# EasyEDA Pro project ProPrj_cap banks_2026-02-15.epro, schematic Schematic2
Board Name: scratchpad; Create Date: 2025-12-29; Page Name: P1; Project Name: cap bank training; Schematic Name: Schematic2; Update Date: 2025-12-30; Company: EasyEDA.com; Page Size: A4; Version: V1.0
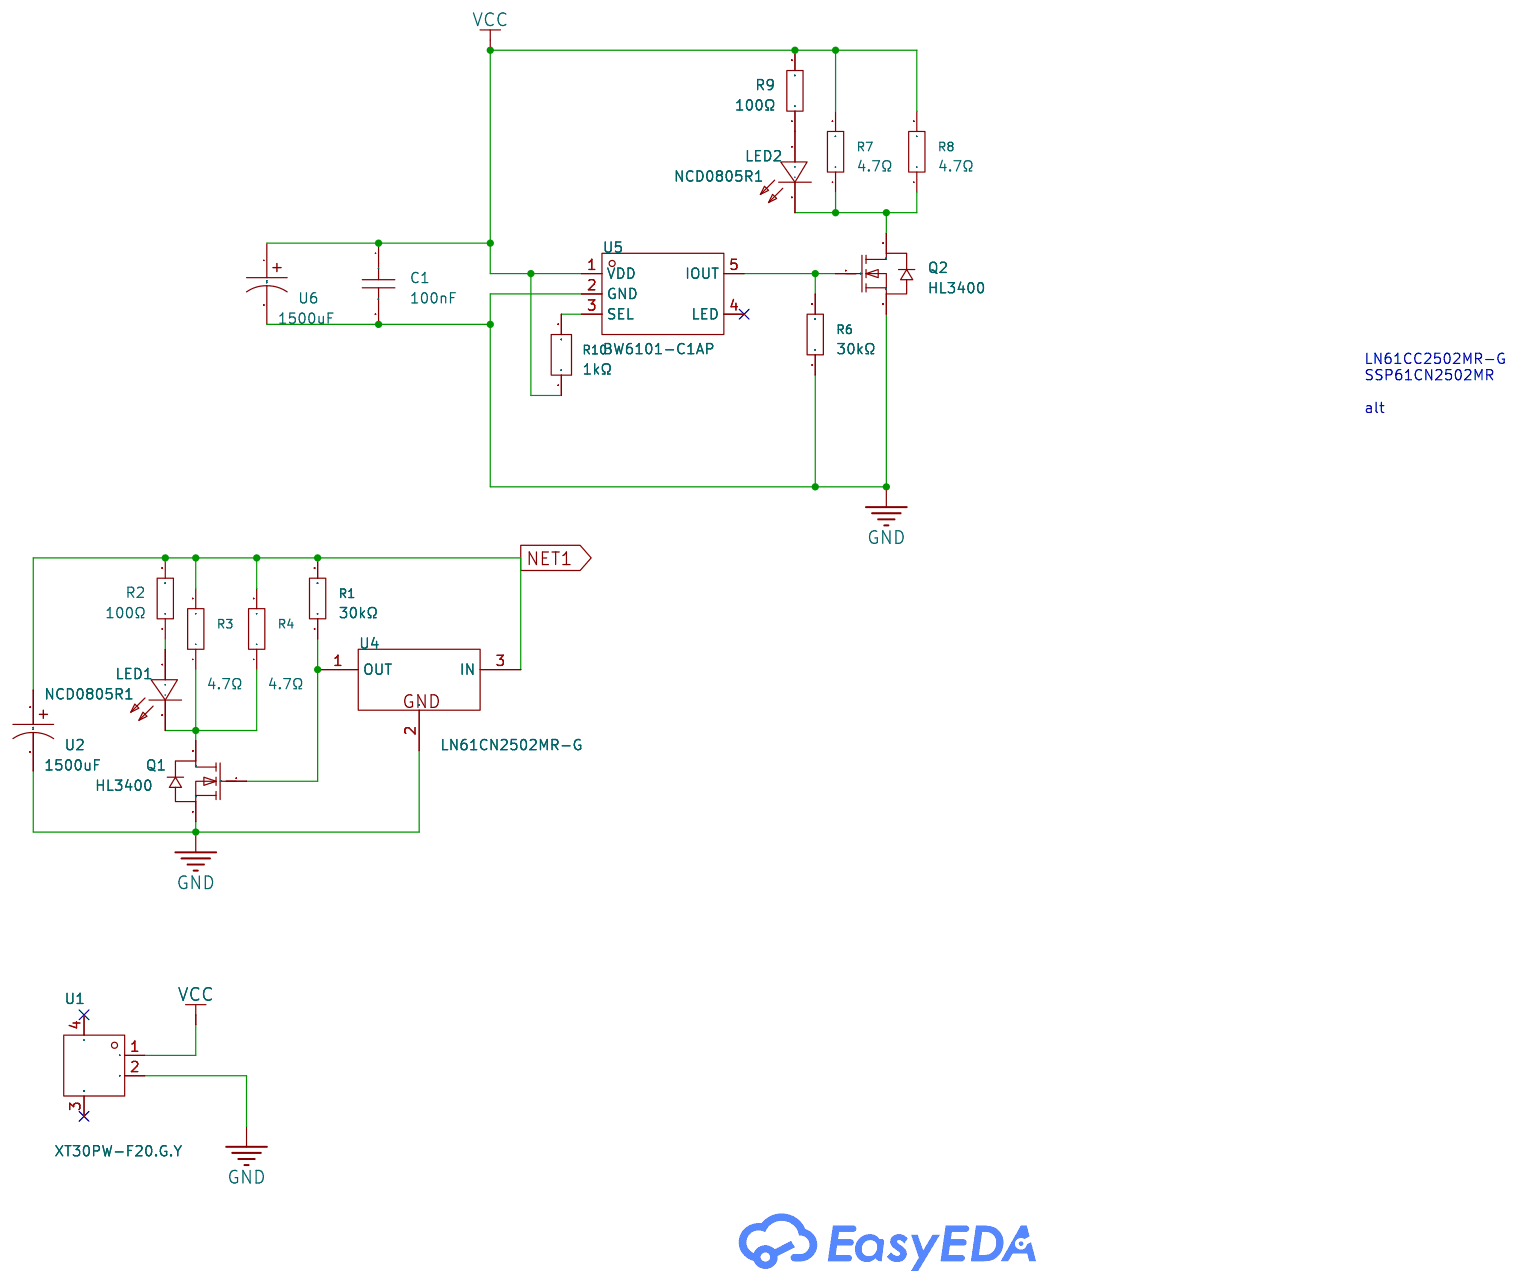
[diagram p1: schematic sheet]

## Parts
C1  100nF  [C0805]
LED1  NCD0805R1  [LED0805-R-RD]
LED2  NCD0805R1  [LED0805-R-RD]
Q1  HL3400  [SOT-23-3_L2.9-W1.3-P1.90-LS2.4-BR]
Q2  HL3400  [SOT-23-3_L2.9-W1.3-P1.90-LS2.4-BR]
R1  30kΩ  [R0805]
R2  100Ω  [R0805]
R3  4.7Ω  [R2512]
R4  4.7Ω  [R2512]
R6  30kΩ  [R0805]
R7  4.7Ω  [R2512]
R8  4.7Ω  [R2512]
R9  100Ω  [R0805]
R10  1kΩ  [R0805]
U1  XT30PW-F20.G.Y  [CONN-TH_XT30PW-F-1]
U2  1500uF  [CAP-TH_BD18.0-P7.50-D0.8-FD]
U4  LN61CN2502MR-G  [SOT-23-3_L2.9-W1.6-P1.90-LS2.8-BR]
U5  BW6101-C1AP  [SOT-23-5_L2.9-W1.6-P0.95-LS2.8-BL]
U6  1500uF  [CAP-TH_BD18.0-P7.50-D0.8-FD]

## Library data of the parts
C1 = FCC0805B104K500DT: Capacitance:100nF Tolerance:±10% Tolerance:±10% Voltage Rating:50V Temperature Coefficient:X7R; LCSC Part Name: 100nF ±10% 50V; Supplier Part: C5137467; Manufacturer: FOJAN(富捷); Supplier Footprint: 0805; JLCPCB Part Class: Extended Part; Datasheet: https://atta.szlcsc.com/upload/public/pdf/source/20220818/0EB3B7FB2F5648AC16609637FBA7DABE.pdf; Supplier: LCSC; Tolerance: ±10%; Voltage Rating: 50V; Temperature Coefficient: X7R
LED1 LED2 = NCD0805R1_C84256: Lamp Holder Type:- Emitted Color:Red Forward Voltage (VF):1.6V~2.6V Forward Voltage (VF):1.6V~2.6V Power Dissipation:65mW Forward Current:20mA Dominant Wavelength:615nm~630nm Dominant Wavelength:615nm~630nm Peak Wavelength:- Diode Configuration:独立二极管 Lens; Supplier Part: C84256; Manufacturer: 国星光电; Supplier Footprint: 0805; JLCPCB Part Class: Basic Part; Datasheet: https://atta.szlcsc.com/upload/public/pdf/source/20200820/C84256_F0A75A43B3EAD75808600A0514C76B99.pdf; Supplier: LCSC; Emitted Color: Red; Forward Voltage (VF): 1.6V~2.6V; Power Dissipation: 65mW; Forward Current: 20mA; Dominant Wavelength: 615nm~630nm; Diode Configuration: 独立二极管; Lens Color: 无色透明透镜; Luminous Intensity: 67mcd~195mcd; Viewing Angle: 130°; Operating Temperature: -30℃~+85℃
Q1 Q2 = HL3400: Type:1 N-channel Drain to Source Voltage:30V Current - Continuous Drain(Id):5.6A RDS(on):33mΩ@4.5V,5A Pd - Power Dissipation:1.2W Gate Threshold Voltage (Vgs(th)@Id):1.5V Gate Charge(Qg):17nC@4.5V Input Capacitance(Ciss@Vds):630pF@15V Reverse Transfer Cap; LCSC Part Name: N-通道,电流:5.6A,耐压:30V; Supplier Part: C22469448; Manufacturer: 宏嘉诚; Supplier Footprint: SOT-23; JLCPCB Part Class: Extended Part; Datasheet: https://atta.szlcsc.com/upload/public/pdf/source/20250106/821A5FA5B3A156C0B96C3BD3FAAD026C.pdf; Supplier: LCSC; Type: 1 N-channel; Drain to Source Voltage: 30V; Current - Continuous Drain(Id): 5.6A; RDS(on): 33mΩ@4.5V,5A; Pd - Power Dissipation: 1.2W; Gate Threshold Voltage (Vgs(th)@Id): 1.5V; Gate Charge(Qg): 17nC@4.5V; Input Capacitance(Ciss@Vds): 630pF@15V; Reverse Transfer Capacitance (Crss@Vds): 71pF@15V; Operating Temperature: -55℃~+150℃
R1 R6 = 0805W8F3002T5E: Type:Thick Film Resistors Resistance:30kΩ Tolerance:±1% Tolerance:±1% Power(Watts): Overload Voltage (Max): Temperature Coefficient:±100ppm/℃ Temperature Coefficient:±100ppm/℃ Operating Temperature Range:-55℃~+155℃ Operating Temperature Range:-55℃~+155℃; LCSC Part Name: 30kΩ ±1% 125mW 厚膜电阻; Supplier Part: C17621; Manufacturer: UNI-ROYAL(厚声); Supplier Footprint: 0805; JLCPCB Part Class: Basic Part; Datasheet: https://atta.szlcsc.com/upload/public/pdf/source/20200306/C422600_1E6D84923E4A46A82E41ADD87F860B5C.pdf; Supplier: LCSC; Type: Thick Film Resistors; Tolerance: ±1%; Temperature Coefficient: ±100ppm/℃; Operating Temperature Range: -55℃~+155℃
R2 R9 = 0805W8F1000T5E_C17408: Type:Thick Film Resistors Resistance: Tolerance:±1% Tolerance:±1% Power(Watts): Overload Voltage (Max): Temperature Coefficient:±100ppm/℃ Temperature Coefficient:±100ppm/℃ Operating Temperature Range:-55℃~+155℃ Operating Temperature Range:-55℃~+155℃; LCSC Part Name: 100Ω ±1% 125mW 厚膜电阻; Supplier Part: C17408; Manufacturer: UNI-ROYAL(厚声); Manufacturer Part: 0805W8F1000T5E; Supplier Footprint: 0805; JLCPCB Part Class: Basic Part; Datasheet: https://atta.szlcsc.com/upload/public/pdf/source/20200306/C422600_1E6D84923E4A46A82E41ADD87F860B5C.pdf; Supplier: LCSC; Type: Thick Film Resistors; Tolerance: ±1%; Temperature Coefficient: ±100ppm/℃; Operating Temperature Range: -55℃~+155℃
R3 R4 R7 R8 = 25121WJ047JT4E: Type:Thick Film Resistors Resistance:4.7Ω Tolerance:±5% Tolerance:±5% Power(Watts): Overload Voltage (Max): Temperature Coefficient:±200ppm/℃ Temperature Coefficient:±200ppm/℃ Operating Temperature Range:-55℃~+155℃ Operating Temperature Range:-55℃~+155℃; LCSC Part Name: 4.7Ω ±5% 1W 厚膜电阻; Supplier Part: C25489; Manufacturer: UNI-ROYAL(厚声); Supplier Footprint: 2512; JLCPCB Part Class: Extended Part; Datasheet: https://atta.szlcsc.com/upload/public/pdf/source/20200306/C422600_1E6D84923E4A46A82E41ADD87F860B5C.pdf; Supplier: LCSC; Type: Thick Film Resistors; Tolerance: ±5%; Temperature Coefficient: ±200ppm/℃; Operating Temperature Range: -55℃~+155℃
R10 = FRC0805J102 TS: Type:Thick Film Resistors Resistance:1kΩ Tolerance:±5% Tolerance:±5% Power(Watts): Overload Voltage (Max): Temperature Coefficient:±100ppm/℃ Temperature Coefficient:±100ppm/℃ Operating Temperature Range:-55℃~+155℃ Operating Temperature Range:-55℃~+155℃; LCSC Part Name: 1kΩ ±5% 125mW 厚膜电阻; Supplier Part: C2907295; Manufacturer: FOJAN(富捷); Supplier Footprint: 0805; JLCPCB Part Class: Extended Part; Datasheet: https://atta.szlcsc.com/upload/public/pdf/source/20211221/925EC7D7225764EE0046F22065062C87.pdf; Supplier: LCSC; Type: Thick Film Resistors; Tolerance: ±5%; Temperature Coefficient: ±100ppm/℃; Operating Temperature Range: -55℃~+155℃
U1 = XT30PW-F20.G.Y: Power:- Output:- Input:- Size:- Interface:- Type:- Colour:- MaximumCurrent:- Type:航模插头 RatedVoltage:- Type1:- NumberOfUSBHoles:- InterfaceType:母头 MetalMaterial:- InsulationMaterial:- RatedCurrent:- RecommendedWireGauge:- FlameRetardantGrade:- contact resi; LCSC Part Name: AMASS(艾迈斯)电源连接器 母头 XT30PW-F; Supplier Part: C2913282; Manufacturer: AMASS(艾迈斯); JLCPCB Part Class: Extended Part; Datasheet: https://atta.szlcsc.com/upload/public/pdf/source/20231218/06CFCF98887A9A87638B0856A725C8FD.pdf; Supplier: LCSC; Type: 航模插头; InterfaceType: 母头
U2 U6 = 80ZLH1500MEFC18X40: Capacitance: Tolerance:±20% Tolerance:±20% Rated Voltage: Ripple Current:- Equivalent Series Resistance(ESR):- Lead Spacing:7.5mm φD: L: Lifetime @ Temp:- Operating Temperature:-40℃~+105℃ Operating Temperature:-40℃~+105℃; LCSC Part Name: 1500uF ±20% 80V; Supplier Part: C700879; Manufacturer: rubycon(红宝石); Supplier Footprint: 插件,D18xL40mm; JLCPCB Part Class: Extended Part; Datasheet: https://atta.szlcsc.com/upload/public/pdf/source/20200710/C700879_22A88F1D2FB7159B35BD93EA845084AE.pdf; Supplier: LCSC; Tolerance: ±20%; Lead Spacing: 7.5mm; Operating Temperature: -40℃~+105℃
U4 = LN61CN2502MR-G: LCSC Part Name: 高精度 低功耗 小封装 电压检测芯片; Supplier Part: C3008034; Manufacturer: natlinear(南麟); Supplier Footprint: SOT-23-3L; JLCPCB Part Class: Extended Part; Datasheet: https://atta.szlcsc.com/upload/public/pdf/source/20220425/1D5109EE5993FFA3DF00E8F2F8419593.pdf; Supplier: LCSC
U5 = BW6101-C1AP: test bw6101; Supplier Part: C511549; Supplier Footprint: SOT-23-5L; JLCPCB Part Class: Extended Part; Supplier: LCSC

## Nets
GND: C1.2 Q1.2(S) Q2.2(S) R6.1 U1.2 U2.2 U4.2(GND) U5.2(GND) U6.2
VCC: C1.1 R7.2 R8.2 R9.2 R10.1 U1.1 U5.1(VDD) U6.1
NET1: R1.2 R2.2 R3.2 R4.2 U2.1 U4.3(IN)
Net-(LED1-1): LED1.1(+) R2.1
Net-(LED1-2): LED1.2(-) Q1.3(D) R3.1 R4.1
Net-(LED2-1): LED2.1(+) R9.1
Net-(LED2-2): LED2.2(-) Q2.3(D) R7.1 R8.1
Net-(Q1-1): Q1.1(G) R1.1 U4.1(OUT)
Net-(Q2-1): Q2.1(G) R6.2 U5.5(IOUT)
Net-(R10-2): R10.2 U5.3(SEL)

Not connected (* = marked no-connect by the designer): U1 3* 4*; U5 4(LED)*

## Notes on the sheet
- LN61CC2502MR-G
  SSP61CN2502MR
  alt
